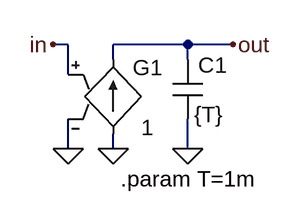
[diagram p0: schematic Int.asc]
Int.asc, the LTspice schematic file:
Version 4
SHEET 1 880 680
WIRE 96 128 80 128
WIRE 224 128 144 128
WIRE 272 128 224 128
WIRE 144 144 144 128
WIRE 224 144 224 128
WIRE 96 160 96 128
WIRE 96 240 96 208
WIRE 144 240 144 224
WIRE 224 240 224 208
FLAG 144 240 0
FLAG 96 240 0
FLAG 272 128 out
FLAG 80 128 in
FLAG 224 240 0
SYMBOL g 144 128 R0
WINDOW 0 21 25 Left 0
WINDOW 3 30 89 Left 0
SYMATTR InstName G1
SYMATTR Value 1
SYMBOL cap 208 144 R0
WINDOW 0 27 6 Left 0
WINDOW 3 23 59 Left 0
SYMATTR InstName C1
SYMATTR Value {T}
TEXT 152 272 Left 0 !.param T=1m

The netlist it stands for:
* Int.asc
G1 0 out in 0 1
C1 out 0 {T}
.param T=1m
.backanno
.end